# Altium project TimeDrive.PrjPcb (part 2 of 3)

## Sheet 10-Microcontroller-1.SchDoc
size A; SheetNumber: 10; SheetTotal: 16
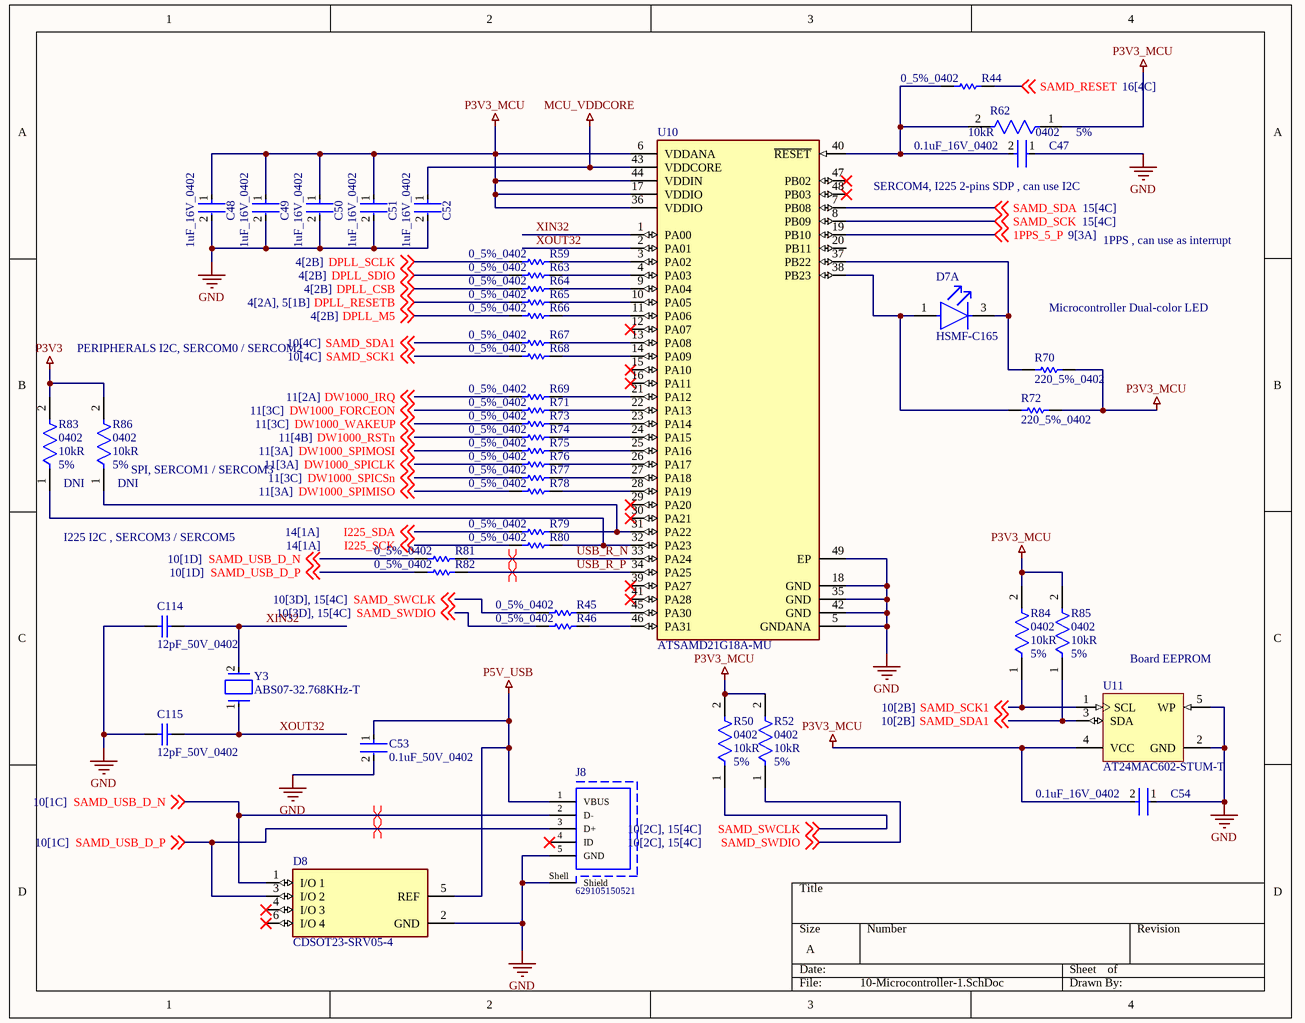
[diagram p6: 10-Microcontroller-1.SchDoc]

### Parts
C47  0.1uF_16V_0402  [FP-GRM15-MFG]
C48  1uF_16V_0402  [FP-0402-L_1_0_0_05-W_0_5-IPC_A]
C49  1uF_16V_0402  [FP-0402-L_1_0_0_05-W_0_5-IPC_A]
C50  1uF_16V_0402  [FP-0402-L_1_0_0_05-W_0_5-IPC_A]
C51  1uF_16V_0402  [FP-0402-L_1_0_0_05-W_0_5-IPC_A]
C52  1uF_16V_0402  [FP-0402-L_1_0_0_05-W_0_5-IPC_A]
C53  0.1uF_50V_0402  [FP-C1005-050-0_05-IPC_C]
C54  0.1uF_16V_0402  [FP-GRM15-MFG]
C114  12pF_50V_0402  [CAPC1005X55X25LL05T05]
C115  12pF_50V_0402  [CAPC1005X55X25LL05T05]
D7  HSMF-C165  [FP-HSMF-C165-MFG]  (part A of 2)
D8  CDSOT23-SRV05-4  [FP-CDSOT23-SRV05-4-MFG]
J8  629105150521  [629105150521]
R44  0_5%_0402  [RESC1005X40X25LL10T10]
R45  0_5%_0402  [RESC1005X40X25LL10T10]
R46  0_5%_0402  [RESC1005X40X25LL10T10]
R50  Case/Package: 0402  Resistance: 10kR  Tolerance: 5%  [FP-CRCW0402-e3-IPC_B]  (hidden comment: CRCW040210K0JNED)
R52  Case/Package: 0402  Resistance: 10kR  Tolerance: 5%  [FP-CRCW0402-e3-IPC_B]  (hidden comment: CRCW040210K0JNED)
R59  0_5%_0402  [RESC1005X40X25LL10T10]
R62  Case/Package: 0402  Resistance: 10kR  Tolerance: 5%  [FP-CRCW0402-e3-IPC_B]  (hidden comment: CRCW040210K0JNED)
R63  0_5%_0402  [RESC1005X40X25LL10T10]
R64  0_5%_0402  [RESC1005X40X25LL10T10]
R65  0_5%_0402  [RESC1005X40X25LL10T10]
R66  0_5%_0402  [RESC1005X40X25LL10T10]
R67  0_5%_0402  [RESC1005X40X25LL10T10]
R68  0_5%_0402  [RESC1005X40X25LL10T10]
R69  0_5%_0402  [RESC1005X40X25LL10T10]
R70  220_5%_0402  [RESC1005X40X25ML05T05]
R71  0_5%_0402  [RESC1005X40X25LL10T10]
R72  220_5%_0402  [RESC1005X40X25ML05T05]
R73  0_5%_0402  [RESC1005X40X25LL10T10]
R74  0_5%_0402  [RESC1005X40X25LL10T10]
R75  0_5%_0402  [RESC1005X40X25LL10T10]
R76  0_5%_0402  [RESC1005X40X25LL10T10]
R77  0_5%_0402  [RESC1005X40X25LL10T10]
R78  0_5%_0402  [RESC1005X40X25LL10T10]
R79  0_5%_0402  [RESC1005X40X25LL10T10]
R80  0_5%_0402  [RESC1005X40X25LL10T10]
R81  0_5%_0402  [RESC1005X40X25LL10T10]
R82  0_5%_0402  [RESC1005X40X25LL10T10]
R83  Case/Package: 0402  Resistance: 10kR  Tolerance: 5%  [FP-CRCW0402-e3-IPC_B]  (hidden comment: CRCW040210K0JNED)
R84  Case/Package: 0402  Resistance: 10kR  Tolerance: 5%  [FP-CRCW0402-e3-IPC_B]  (hidden comment: CRCW040210K0JNED)
R85  Case/Package: 0402  Resistance: 10kR  Tolerance: 5%  [FP-CRCW0402-e3-IPC_B]  (hidden comment: CRCW040210K0JNED)
R86  Case/Package: 0402  Resistance: 10kR  Tolerance: 5%  [FP-CRCW0402-e3-IPC_B]  (hidden comment: CRCW040210K0JNED)
U10  ATSAMD21G18A-MU  [FP-C04-21493-MFG]
U11  AT24MAC602-STUM-T  [ATML-5TS1_M]
Y3  ABS07-32.768KHz-T  [FP-ABS07-MFG]

### Nets
GND: C47.1 C48.2 C49.2 C50.2 C51.2 C52.2 C53.2 C54.1 C114.2 C115.2 D8.2(GND) J8.5(GND) J8.Shell(Shield) U10.5(GNDANA) U10.18(GND) U10.35(GND) U10.42(GND) U10.49(EP) U11.2(GND) U11.5(WP)
MCU_VDDCORE: C52.1 U10.43(VDDCORE)
P3V3: R83.2 R86.2
P3V3_MCU: C48.1 C49.1 C50.1 C51.1 C54.2 R50.2 R52.2 R62.1 R70.2 R72.2 R84.2 R85.2 U10.6(VDDANA) U10.17(VDDIO) U10.36(VDDIO) U10.44(VDDIN) U11.4(VCC)
P5V_USB: C53.1 D8.5(REF) J8.1(VBUS)
1PPS_5_P: U10.19(PB10) ; off-sheet 1PPS_5_P
DPLL_CSB: R64.1 ; off-sheet DPLL_CSB
DPLL_M5: R66.1 ; off-sheet DPLL_M5
DPLL_RESETB: R65.1 ; off-sheet DPLL_RESETB
DPLL_SCLK: R59.1 ; off-sheet DPLL_SCLK
DPLL_SDIO: R63.1 ; off-sheet DPLL_SDIO
DW1000_FORCEON: R71.1 ; off-sheet DW1000_FORCEON
DW1000_IRQ: R69.1 ; off-sheet DW1000_IRQ
DW1000_RSTn: R74.1 ; off-sheet DW1000_RSTn
DW1000_SPICLK: R76.1 ; off-sheet DW1000_SPICLK
DW1000_SPICSn: R77.1 ; off-sheet DW1000_SPICSn
DW1000_SPIMISO: R78.1 ; off-sheet DW1000_SPIMISO
DW1000_SPIMOSI: R75.1 ; off-sheet DW1000_SPIMOSI
DW1000_WAKEUP: R73.1 ; off-sheet DW1000_WAKEUP
I225_SCK: R80.1 ; off-sheet I225_SCK
I225_SDA: R79.1 ; off-sheet I225_SDA
SAMD_RESET: R44.2 ; off-sheet SAMD_RESET
SAMD_SCK: U10.8(PB09) ; off-sheet SAMD_SCK
SAMD_SCK1: R68.1 R84.1 U11.1(SCL) ; off-sheet SAMD_SCK1
SAMD_SDA: U10.7(PB08) ; off-sheet SAMD_SDA
SAMD_SDA1: R67.1 R85.1 U11.3(SDA) ; off-sheet SAMD_SDA1
SAMD_SWCLK: R45.1 R50.1 ; off-sheet SAMD_SWCLK
SAMD_SWDIO: R46.1 R52.1 ; off-sheet SAMD_SWDIO
SAMD_USB_D_N: D8.1(I/O_1) J8.2(D-) R81.1 ; off-sheet SAMD_USB_D_N
SAMD_USB_D_P: D8.3(I/O_2) J8.3(D+) R82.1 ; off-sheet SAMD_USB_D_P
USB_R_N: R81.2 U10.33(PA24)
USB_R_P: R82.2 U10.34(PA25)
XIN32: C114.1 U10.1(PA00) Y3.2
XOUT32: C115.1 U10.2(PA01) Y3.1
NetC47_2: C47.2 R44.1 R62.2 U10.40(~{RESET})
NetD7_1: D7.1(GREEN_A) R72.1 U10.38(PB23)
NetD7_3: D7.3(GREEN_C) R70.1 U10.37(PB22)
NetR45_2: R45.2 U10.45(PA30)
NetR46_2: R46.2 U10.46(PA31)
NetR59_2: R59.2 U10.3(PA02)
NetR63_2: R63.2 U10.4(PA03)
NetR64_2: R64.2 U10.9(PA04)
NetR65_2: R65.2 U10.10(PA05)
NetR66_2: R66.2 U10.11(PA06)
NetR67_2: R67.2 U10.13(PA08)
NetR68_2: R68.2 U10.14(PA09)
NetR69_2: R69.2 U10.21(PA12)
NetR71_2: R71.2 U10.22(PA13)
NetR73_2: R73.2 U10.23(PA14)
NetR74_2: R74.2 U10.24(PA15)
NetR75_2: R75.2 U10.25(PA16)
NetR76_2: R76.2 U10.26(PA17)
NetR77_2: R77.2 U10.27(PA18)
NetR78_2: R78.2 U10.28(PA19)
NetR79_2: R79.2 R86.1 U10.31(PA22)
NetR80_2: R80.2 R83.1 U10.32(PA23)

Not connected (* = marked no-connect by the designer): D8 4(I/O_3)* 6(I/O_4)*; J8 4(ID)*; U10 12(PA07)* 15(PA10)* 16(PA11)* 20(PB11) 29(PA20)* 30(PA21)* 39(PA27)* 41(PA28)* 47(PB02)* 48(PB03)*

### Layout directives
differential pair: SAMD_USB_D_N, SAMD_USB_D_P, USB_R_N, USB_R_P

### Notes on the sheet
- (near C47) SERCOM4, I225 2-pins SDP , can use I2C
- 1PPS , can use as interrupt
- PERIPHERALS I2C, SERCOM0 / SERCOM2
- Microcontroller Dual-color LED
- (near R86) SPI, SERCOM1 / SERCOM3
- I225 I2C , SERCOM3 / SERCOM5
- (near U11) Board EEPROM

### Library data of the parts
C47 C54 = CMP-2100-03641-2: CAP CER 0.1UF 16V X7R 0402; Manufacturer Part Number: GRM155R71C104KA88D; Manufacturer: Murata; Standoff Height: 0mm; Tolerance: 10%; Voltage Rating: 16Vdc; Material: Ceramic; Capacitance: 0.10μF; Value: 0.10μF; RoHS: TRUE; Temperature Characteristic: X7R; Octopart: https://octopart.com/grm155r71c104ka88d-murata-196880; Digikey Description: CAP CER 0.1UF 16V X7R 0402; Device Class L3: Ceramic Capacitors; Height: 0.55mm; ComponentLink2Description: Datasheet; Temperature Range Low: -55°C; Ipc Land Pattern Name: CAPC10050X219; ComponentLink2URL: https://search.murata.co.jp/Ceramy/image/img/A01X/G101/ENG/GRM155R71H471KA01-01A.pdf; Device Class L1: Passive Components; Lead Free: yes; Category: Cap; Package: GRM15; Temperature: -55°C to +125°C; Device Class L2: Capacitors; Temperature Range High: +125°C; Mouser Description: 0402 0.1 uF 16V ±10 % Tolerance X7R SMT Multilayer Ceramic Capacitor
C48-C52 = CMP-14477-000104-2: None; Tolerance: 10%; Voltage Rating: 16V; Dielectric: X5R; Capacitance: 1uF; Packaging: Tape and Reel; Depth: 0.5mm; Mount: Surface Mount; Thickness: 0.022inch; Package Quantity: 1; Min Operating Temperature: -55°C; Series: M; Voltage Rating (DC): 16V; Termination: SMD/SMT; Case/Package: 0402; Number of Pins: 2; Case Code (Imperial): 0402; Length: 1mm; Halogen Free: Halogen Free; Case Code (Metric): 1005; Width: 0.02inch; RoHS Compliant: Yes; Radiation Hardening: No; Max Operating Temperature: 85°C; Height: 0.5mm; Construction: Flat
C53 = CMP-2000-05393-2: Multilayer Ceramic Capacitors 100nF ±10% 50V X7R SMD 0402; Voltage: 50V; Dielectric Material: Ceramic; Min Operating Temperature: -55°C; Depth: 0.5mm; Radiation Hardening: No; RoHS Compliant: Yes; Voltage Rating (DC): 50V; Lead Free: Lead Free; Resistor Type: Ceramic; Height: 0.5mm; Dielectric: X7R; Thickness: 0.022inch; Case/Package: 0402; Case Code (Metric): 1005; Termination: SMD/SMT; Capacitance: 100nF; Packaging: Tape and Reel; Max Operating Temperature: 125°C; Mount: Surface Mount; Package Quantity: 1; Width: 0.02inch; Weight: 2.3E-05oz; Voltage Rating: 50V; Tolerance: 10%; Construction: Flat; Case Code (Imperial): 0402; Length: 1mm; REACH SVHC: No SVHC; Series: C
C114 C115 = CMP-2000-06069-1: Chip Capacitor, 12 pF, +/- 5%, 50 V, -55 to 125 degC, 0402 (1005 Metric), RoHS, Tape and Reel; Manufacturer: Yageo; Capacitance: 12pF; Voltage - Rated: 50V; Other Names: 311-1016-6311-1266-6311-1266-6-ND; Catalog Drawings: CC_0402; Featured Product: CommodityMultilayerCeramicCapacitors–CCSeries; Product Training Modules: MultilayerCeramicCapacitors; Online Catalog: CCSeries; Temperature Coefficient: C0G,NP0; Mounting Technology: SurfaceMount; Package Reference: 0402; Lead Style: -; Datasheet URL: http://www.yageo.com/NewPortal/yageodocoutput?fileName=/pdf/MLCC/UPY-GP_NP0_16V-to-50V_14.pdf; Height - Seated (Max): -; Mounting Type: SurfaceMount,MLCC; Series: CC; Standard Package: 1; Manufacturer URL: http://www.yageo.com/; Package / Case: 0402(1005Metric); Features: -; Applications: GeneralPurpose; Family: CeramicCapacitors; Size / Dimension: 0.039"Lx0.020"W(1.00mmx0.50mm); Ratings: -; Package Description: 2-Pin Surface Mount Device, Body 1 x 0.5 mm; Datasheet Version: Rev. 14, 07/2016; Lead Spacing: -; Packaging: Digi-Reel®; Category: Capacitors; Tolerance: ±5%; Thickness (Max): 0.022"(0.55mm); Operating Temperature: -55°C~125°C
D7 = CMP-2000-06424-2: LED GREEN/RED DIFFUSED 0603 SMD; Reverse Voltage: 5V; Dominant Wavelength: 621nm; Number of Elements: 2; Shape: Rectangular; Luminous Intensity: 10mcd; Forward Current: 20mA; Lens Color: White; Illumination Color: Green; Power Dissipation: 52mW; Wavelength: 572nm; Viewing Angle: 120°; Forward Voltage: 2.2V; Max Operating Temperature: 85°C; Lens Transparency: Diffused; Width: 0.8mm; Case/Package: 0603; Packaging: Tape and Reel; Case Code (Metric): 1608; Depth: 0.8mm; REACH SVHC: No SVHC; Number of LEDs: 2; Radiation Hardening: No; Lens Style: Rectangular; Color: Green; Case Code (Imperial): 0603; Min Operating Temperature: -40°C; Power Rating: 52mW; Number of Pins: 4; Number of Terminals: 4; Package Quantity: 1; Mount: Surface Mount; Height: 0.5mm; Length: 1.6mm; Lead Free: Lead Free; Test Current: 20mA
D8 = CMP-07401-000007-1: TVS DIODE 5V 15V SOT23-6; Manufacturer: Bourns Inc.; Standoff Height: 0.2mm; Direction: Bidirectional; Peak Pulse Power: 500W; Max Junction Temp: +150°C; Number Of Channels: 4; Breakdown Voltage: 6V; Peak Pulse Current: 30A; Temperature Range High: +150°C; RoHS: TRUE; Category: Diode; Clamping Voltage: 15V; Reverse Standoff Voltage: 5V; Manufacturer Part Number: CDSOT23-SRV05-4; Octopart: https://octopart.com/cdsot23-srv05-4-bourns-1679449; Automotive: No; ComponentLink2URL: https://www.bourns.com/docs/Product-Datasheets/CDSOT23-SRV05-4.pdf; Device Class L1: Circuit Protection; Temperature: -55°C to +150°C; Device Class L2: TVS Diodes; Temperature Range Low: -55°C; Lead Free: Yes; Device Class L3: unset; Height: 1.45mm; Package: CDSOT23-SRV05-4; Ipc Land Pattern Name: SOT95P280X118-6; Mouser Description: CDSOT23-SRV05-4, Quad Uni-Directional TVS Diode, 500W, 6-Pin SOT-23; ComponentLink2Description: Datasheet; Digikey Description: TVS DIODE 5V 15V SOT23-6
J8 = CMP-1502-03252-1: Micro USB 2.0 Type B Receptacle WR-COM, Horizontal, SMT, with Pegs, High Current at Pin 1 & Pin 5; Manufacturer: Wurth Elektronik; Contact Resistance: 30mOhm; Rated Current: 3A; Working Voltage: 30VAC; Package Reference: 629105150521; Mounting Technology: SMT; Connector Type: MicroUSB2.0TypeB; Operating Temperature: -40to85degC; Orientation: Horizontal; Manufacturer URL: http://www.we-online.de; Datasheet URL: https://katalog.we-online.de/em/datasheet/629105150521.pdf; Part Number: 629105150521; Packaging: TapeandReel; Gender: Receptacle; Publisher: WurthElektronik
R44-R46 R59 R63-R69 R71 R73-R82 = CMP-2002-04569-1: Manufacturer: KOA Speer; Part Number: RK73Z1ETTP
R50 R52 R62 R83-R86 = CMP-2002-08136-3: RES Thick Film, 10kΩ, 5%, 0.063W, 200ppm/°C, 0402; Voltage Rating: 50V; Power Rating: 63mW; Military Standard: Not; Packaging: Tape and Reel; Case Code (Imperial): 0402; Min Operating Temperature: -55°C; Case Code (Metric): 1005; Temperature Coefficient: 200ppm/°C; Termination: SMD/SMT; Composition: Thick Film; Depth: 0.5mm; Number of Terminations: 2; Contact Plating: Tin; Height: 0.016inch; Width: 0.5mm; Max Operating Temperature: 155°C; Features: Automotive AEC-Q200; Length: 1mm; Radiation Hardening: No; Max Power Dissipation: 63mW; Mount: Surface Mount; Package Quantity: 1; Weight: 2.3E-05oz
  R83 R86: DNI: DNI
R70 R72 = CMP-2002-00486-1: Manufacturer: Panasonic; Part Number: ERJ-2GEJ220X
U10 = CMP-06276-000052-1: IC MCU 32BIT 256KB FLASH 48QFN; Interface: I2C; Oscillator Type: Internal; Core Architecture: ARM; Peripherals: Brown-out Detect/Reset; Number of I/Os: 38; Frequency: 48MHz; Max Operating Temperature: 85°C; Memory Size: 256KB; Memory Type: FLASH; Case/Package: QFN; Packaging: Tray; Min Operating Temperature: -40°C
U11 = CMP-2100-03583-1: 2-Kbit (256 x 8), 2-wire Serial EEPROM with a Factory-Programmed EUI-64(TM)Address Plus an Embedded Unique 128-bit Serial Number, 1.7 to 5.5 V, -40 to 85 degC, 5-Pin SOT23 (5TS1), Tape and Reel; Manufacturer: Atmel; Min Supply Voltage: 1.7V; Nominal Supply Current: 3mA; Max Frequency: 1MHz; Max Supply Voltage: 5.5V; Number of Pins: 5; RoHSCompliant: true; Mount: SurfaceMount; Datasheet URL: http://www.atmel.com/Images/Atmel-8807-SEEPROM-AT24MAC402-602-Datasheet.pdf; Frequency: 1MHz; Min Operating Temperature: -40degC; Package Reference: 5TS1; Radiation Hardening: No; Package Description: 5-Pin Plastic Thin Shrink Small Outline Package, Body 2.9 x 1.6 mm, Pitch 0.95 mm; Package Quantity: 5000; Packaging: TapeandReel; Max Operating Temperature: 85degC; Case/Package: SOT-23; Manufacturer URL: http://www.atmel.com/; Datasheet Version: Rev. 8808E, 01/2015
Y3 = CMP-0447-00001-3: CRYSTAL 32.7680KHZ 12.5PF SMD; Frequency Tolerance: 20ppm; Series Resistance: 70kR; Operating Frequency: 32.768 kHz; Number of Pins: 2; Package Quantity: 3000; Tolerance: 20ppm; Max Operating Temperature: 85°C; Width: 0.061inch; Frequency: 32.768kHz; Termination: SMD/SMT; Min Operating Temperature: -40°C; Radiation Hardening: No; Series: ABS07; Length: 3.2mm; Case/Package: CSMD; ESR (Equivalent Series Resistance): 70kR; RoHS Compliant: Yes; Load Capacitance: 12.5pF; Depth: 1.5mm; REACH SVHC: No SVHC; Height: 0.035inch; Packaging: Tape and Reel; Lead Free: Lead Free

## Sheet 11-UWB-Main.SchDoc
size A; SheetNumber: 11; SheetTotal: 16
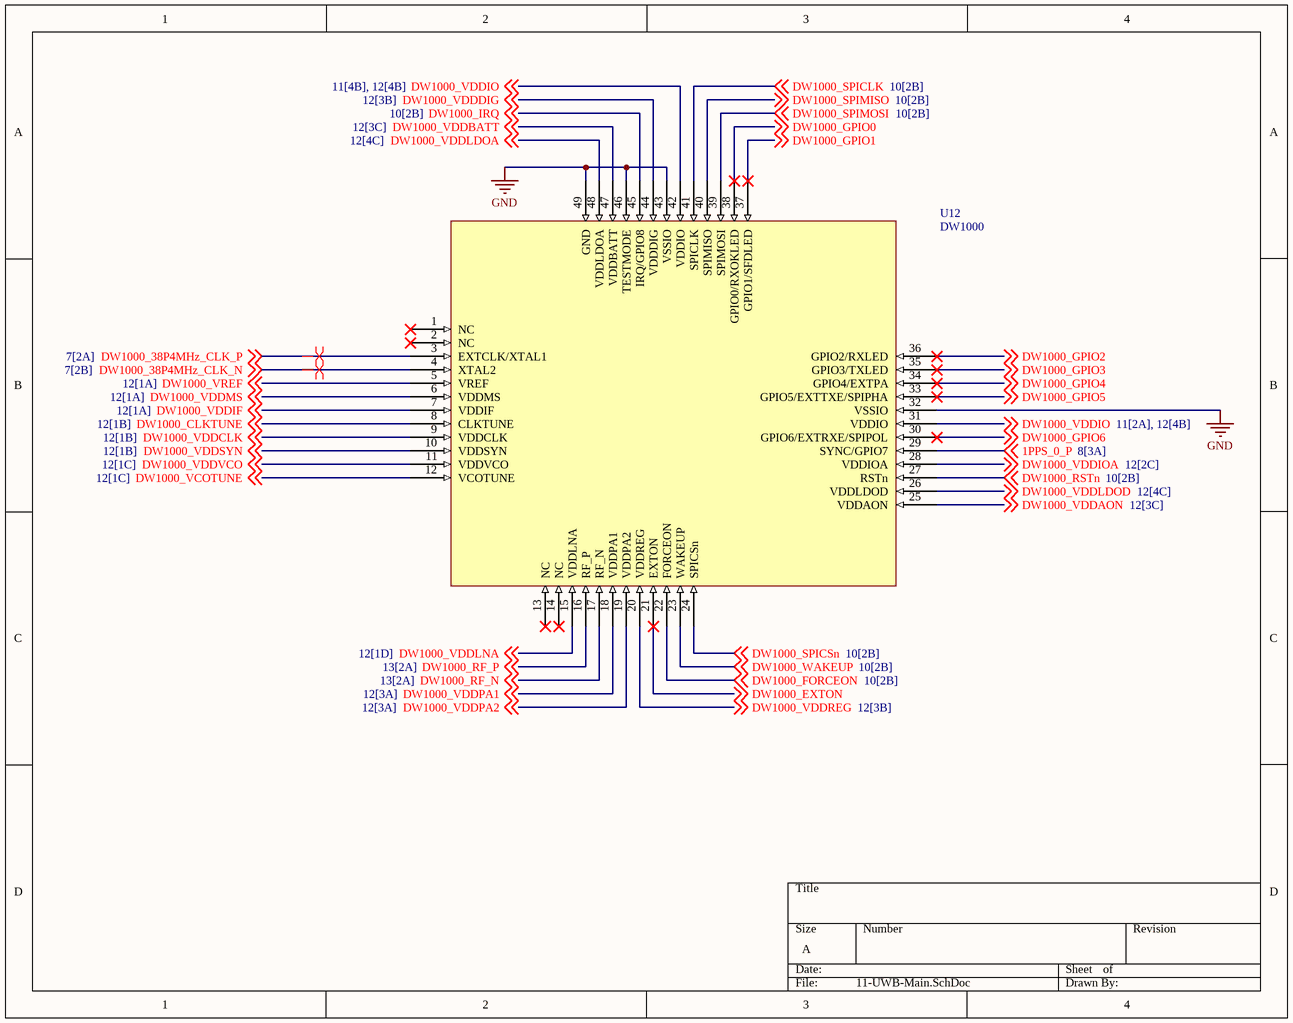
[diagram p7: 11-UWB-Main.SchDoc]

### Parts
U12  DW1000  [DW1000_Footprint]

### Nets
GND: U12.32(VSSIO) U12.43(VSSIO) U12.46(TESTMODE) U12.49(GND)
1PPS_0_P: U12.29(SYNC/GPIO7) ; off-sheet 1PPS_0_P
DW1000_38P4MHz_CLK_N: U12.4(XTAL2) ; off-sheet DW1000_38P4MHz_CLK_N
DW1000_38P4MHz_CLK_P: U12.3(EXTCLK/XTAL1) ; off-sheet DW1000_38P4MHz_CLK_P
DW1000_CLKTUNE: U12.8(CLKTUNE) ; off-sheet DW1000_CLKTUNE
DW1000_EXTON: U12.21(EXTON) ; off-sheet DW1000_EXTON
DW1000_FORCEON: U12.22(FORCEON) ; off-sheet DW1000_FORCEON
DW1000_GPIO0: U12.38(GPIO0/RXOKLED) ; off-sheet DW1000_GPIO0
DW1000_GPIO1: U12.37(GPIO1/SFDLED) ; off-sheet DW1000_GPIO1
DW1000_GPIO2: U12.36(GPIO2/RXLED) ; off-sheet DW1000_GPIO2
DW1000_GPIO3: U12.35(GPIO3/TXLED) ; off-sheet DW1000_GPIO3
DW1000_GPIO4: U12.34(GPIO4/EXTPA) ; off-sheet DW1000_GPIO4
DW1000_GPIO5: U12.33(GPIO5/EXTTXE/SPIPHA) ; off-sheet DW1000_GPIO5
DW1000_GPIO6: U12.30(GPIO6/EXTRXE/SPIPOL) ; off-sheet DW1000_GPIO6
DW1000_IRQ: U12.45(IRQ/GPIO8) ; off-sheet DW1000_IRQ
DW1000_RF_N: U12.17(RF_N) ; off-sheet DW1000_RF_N
DW1000_RF_P: U12.16(RF_P) ; off-sheet DW1000_RF_P
DW1000_RSTn: U12.27(RSTn) ; off-sheet DW1000_RSTn
DW1000_SPICLK: U12.41(SPICLK) ; off-sheet DW1000_SPICLK
DW1000_SPICSn: U12.24(SPICSn) ; off-sheet DW1000_SPICSn
DW1000_SPIMISO: U12.40(SPIMISO) ; off-sheet DW1000_SPIMISO
DW1000_SPIMOSI: U12.39(SPIMOSI) ; off-sheet DW1000_SPIMOSI
DW1000_VCOTUNE: U12.12(VCOTUNE) ; off-sheet DW1000_VCOTUNE
DW1000_VDDAON: U12.25(VDDAON) ; off-sheet DW1000_VDDAON
DW1000_VDDBATT: U12.47(VDDBATT) ; off-sheet DW1000_VDDBATT
DW1000_VDDCLK: U12.9(VDDCLK) ; off-sheet DW1000_VDDCLK
DW1000_VDDDIG: U12.44(VDDDIG) ; off-sheet DW1000_VDDDIG
DW1000_VDDIF: U12.7(VDDIF) ; off-sheet DW1000_VDDIF
DW1000_VDDIO: U12.31(VDDIO) U12.42(VDDIO) ; off-sheet DW1000_VDDIO
DW1000_VDDIOA: U12.28(VDDIOA) ; off-sheet DW1000_VDDIOA
DW1000_VDDLDOA: U12.48(VDDLDOA) ; off-sheet DW1000_VDDLDOA
DW1000_VDDLDOD: U12.26(VDDLDOD) ; off-sheet DW1000_VDDLDOD
DW1000_VDDLNA: U12.15(VDDLNA) ; off-sheet DW1000_VDDLNA
DW1000_VDDMS: U12.6(VDDMS) ; off-sheet DW1000_VDDMS
DW1000_VDDPA1: U12.18(VDDPA1) ; off-sheet DW1000_VDDPA1
DW1000_VDDPA2: U12.19(VDDPA2) ; off-sheet DW1000_VDDPA2
DW1000_VDDREG: U12.20(VDDREG) ; off-sheet DW1000_VDDREG
DW1000_VDDSYN: U12.10(VDDSYN) ; off-sheet DW1000_VDDSYN
DW1000_VDDVCO: U12.11(VDDVCO) ; off-sheet DW1000_VDDVCO
DW1000_VREF: U12.5(VREF) ; off-sheet DW1000_VREF
DW1000_WAKEUP: U12.23(WAKEUP) ; off-sheet DW1000_WAKEUP

Not connected (* = marked no-connect by the designer): U12 1(NC)* 2(NC)* 13(NC)* 14(NC)*

### Layout directives
differential pair: DW1000_38P4MHz_CLK_N, DW1000_38P4MHz_CLK_P

## Sheet 13-UWB-Antenna.SchDoc
size A; SheetNumber: 13; SheetTotal: 16
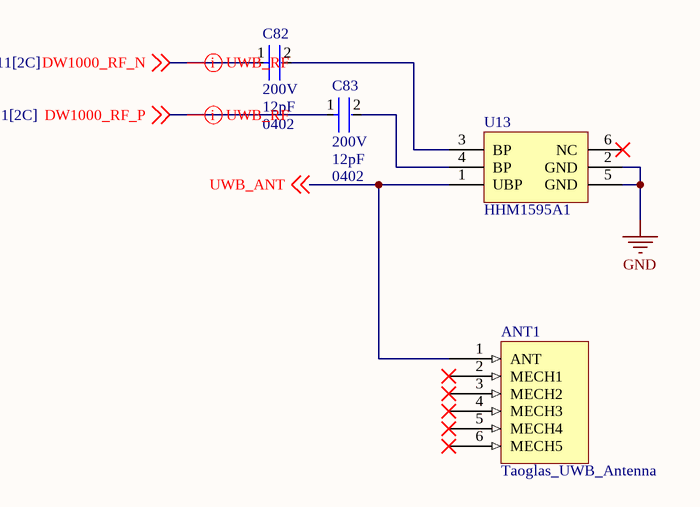
[diagram p8: 13-UWB-Antenna.SchDoc]

### Parts
ANT1  Taoglas_UWB_Antenna  [UWC.20 Antenna]
C82  Voltage Rating (DC): 200V  Capacitance: 12pF  Case/Package: 0402  [FP-GQM155-0_05-MFG]  (hidden comment: GQM1555C2D120FB01D)
C83  Voltage Rating (DC): 200V  Capacitance: 12pF  Case/Package: 0402  [FP-GQM155-0_05-MFG]  (hidden comment: GQM1555C2D120FB01D)
U13  HHM1595A1  [TDK-HHM1595A1_V]

### Nets
GND: U13.2(GND) U13.5(GND)
DW1000_RF_N: C82.1 ; off-sheet DW1000_RF_N
DW1000_RF_P: C83.1 ; off-sheet DW1000_RF_P
UWB_ANT: ANT1.1(ANT) U13.1(UBP) ; off-sheet UWB_ANT
NetC82_2: C82.2 U13.3(BP)
NetC83_2: C83.2 U13.4(BP)

Not connected (* = marked no-connect by the designer): ANT1 2(MECH1)* 3(MECH2)* 4(MECH3)* 5(MECH4)* 6(MECH5)*; U13 6(NC)*

### Layout directives
differential pair: DW1000_RF_N, DW1000_RF_P

### Library data of the parts
C82 C83 = CMP-06035-014182-1: Ceramic Capacitor 12pF  ±1% 200VDC C0G 0402 Paper T/R; Tolerance: 1%; Width: 0.02inch; Dielectric: C0G; Voltage Rating: 200V; Packaging: Tape and Reel; Thickness: 0.022inch; Length: 0.039inch; Mount: Surface Mount; Min Operating Temperature: -55°C; Max Operating Temperature: 125°C
U13 = CMP-2000-07459-1: Multilayer Balun, 3000 to 8000 MHz, -40 to 85 degC, 6-Pin SMD, RoHS, Tape and Reel; Manufacturer: TDK; Case\/Package: 0805; Impedance: 100Ohm; Insertion Loss: 1.5dB; Radiation Hardening: No; Number of Pins: 6; Manufacturer URL: http://www.tdk.com/; Min Operating Temperature: -40degC; Mounting Technology: SurfaceMount; RoHSCompliant: true; Package Description: 6-Pin Surface Mount Device, Body 2 x 1.25 mm, Pitch 0.65 mm; Datasheet URL: https://product.tdk.com/info/en/documents/data_sheet/rf_balun_hhm1595a1_en.pdf; Package Quantity: 1; Max Operating Temperature: 85degC; Packaging: TapeandReel; Package Reference: HHM1595A1; Termination: SMD/SMT; Datasheet Version: 04/2015; Case Code (Imperial): 0805; Case Code (Metric): 2012

## Sheet 14-I225-Main.SchDoc
size A; SheetNumber: 14; SheetTotal: 16
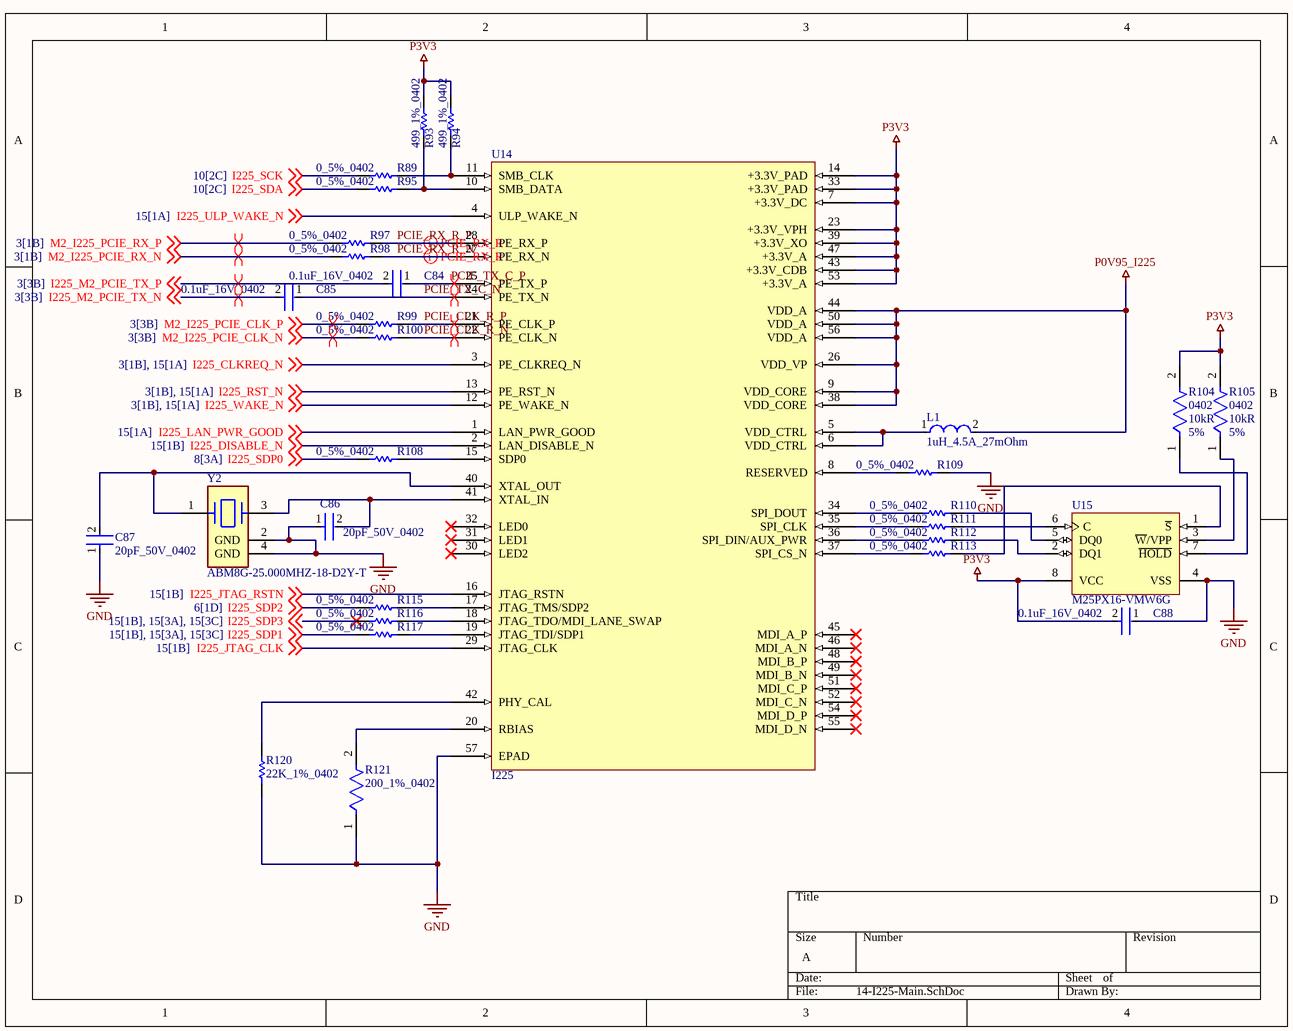
[diagram p9: 14-I225-Main.SchDoc]

### Parts
C84  0.1uF_16V_0402  [FP-GRM15-MFG]
C85  0.1uF_16V_0402  [FP-GRM15-MFG]
C86  20pF_50V_0402  [FP-C0402-BB-MFG]
C87  20pF_50V_0402  [FP-C0402-BB-MFG]
C88  0.1uF_16V_0402  [FP-GRM15-MFG]
L1  1uH_4.5A_27mOhm  [FP-IHLP-1616BZ-FP_1_8545x-MFG]
R89  0_5%_0402  [RESC1005X40X25LL10T10]
R93  499_1%_0402  [RESC1005X40X25LL05T05]
R94  499_1%_0402  [RESC1005X40X25LL05T05]
R95  0_5%_0402  [RESC1005X40X25LL10T10]
R97  0_5%_0402  [RESC1005X40X25LL10T10]
R98  0_5%_0402  [RESC1005X40X25LL10T10]
R99  0_5%_0402  [RESC1005X40X25LL10T10]
R100  0_5%_0402  [RESC1005X40X25LL10T10]
R104  Case/Package: 0402  Resistance: 10kR  Tolerance: 5%  [FP-CRCW0402-e3-IPC_B]  (hidden comment: CRCW040210K0JNED)
R105  Case/Package: 0402  Resistance: 10kR  Tolerance: 5%  [FP-CRCW0402-e3-IPC_B]  (hidden comment: CRCW040210K0JNED)
R108  0_5%_0402  [RESC1005X40X25LL10T10]
R109  0_5%_0402  [RESC1005X40X25LL10T10]
R110  0_5%_0402  [RESC1005X40X25LL10T10]
R111  0_5%_0402  [RESC1005X40X25LL10T10]
R112  0_5%_0402  [RESC1005X40X25LL10T10]
R113  0_5%_0402  [RESC1005X40X25LL10T10]
R115  0_5%_0402  [RESC1005X40X25LL10T10]
R116  0_5%_0402  [RESC1005X40X25LL10T10]
R117  0_5%_0402  [RESC1005X40X25LL10T10]
R120  22K_1%_0402  [RESC1005X40X25NL05T05]
R121  200_1%_0402  [FP-CRCW0402-e3-IPC_C]
U14  I225  [I225 QFN56]
U15  M25PX16-VMW6G  [MICT-MW-8_N]
Y2  ABM8G-25.000MHZ-18-D2Y-T  [FP-ABM8G-MFG]

### Nets
GND: C86.1 C87.1 C88.1 R109.2 R120.1 R121.1 U14.57(EPAD) U15.4(VSS) Y2.2(GND) Y2.4(GND)
P0V95_I225: L1.2 U14.9(VDD_CORE) U14.26(VDD_VP) U14.38(VDD_CORE) U14.44(VDD_A) U14.50(VDD_A) U14.56(VDD_A)
P3V3: C88.2 R93.2 R94.2 R104.2 R105.2 U14.7(+3.3V_DC) U14.14(+3.3V_PAD) U14.23(+3.3V_VPH) U14.33(+3.3V_PAD) U14.39(+3.3V_XO) U14.43(+3.3V_CDB) U14.47(+3.3V_A) U14.53(+3.3V_A) U15.8(VCC)
I225_CLKREQ_N: U14.3(PE_CLKREQ_N) ; off-sheet I225_CLKREQ_N
I225_DISABLE_N: U14.2(LAN_DISABLE_N) ; off-sheet I225_DISABLE_N
I225_JTAG_CLK: U14.29(JTAG_CLK) ; off-sheet I225_JTAG_CLK
I225_JTAG_RSTN: U14.16(JTAG_RSTN) ; off-sheet I225_JTAG_RSTN
I225_LAN_PWR_GOOD: U14.1(LAN_PWR_GOOD) ; off-sheet I225_LAN_PWR_GOOD
I225_M2_PCIE_TX_N: C85.2 ; off-sheet I225_M2_PCIE_TX_N
I225_M2_PCIE_TX_P: C84.2 ; off-sheet I225_M2_PCIE_TX_P
I225_RST_N: U14.13(PE_RST_N) ; off-sheet I225_RST_N
I225_SCK: R89.1 ; off-sheet I225_SCK
I225_SDA: R95.1 ; off-sheet I225_SDA
I225_SDP0: R108.1 ; off-sheet I225_SDP0
I225_SDP1: R117.1 ; off-sheet I225_SDP1
I225_SDP2: R115.1 ; off-sheet I225_SDP2
I225_SDP3: R116.1 ; off-sheet I225_SDP3
I225_ULP_WAKE_N: U14.4(ULP_WAKE_N) ; off-sheet I225_ULP_WAKE_N
I225_WAKE_N: U14.12(PE_WAKE_N) ; off-sheet I225_WAKE_N
M2_I225_PCIE_CLK_N: R100.1 ; off-sheet M2_I225_PCIE_CLK_N
M2_I225_PCIE_CLK_P: R99.1 ; off-sheet M2_I225_PCIE_CLK_P
M2_I225_PCIE_RX_N: R98.1 ; off-sheet M2_I225_PCIE_RX_N
M2_I225_PCIE_RX_P: R97.1 ; off-sheet M2_I225_PCIE_RX_P
PCIE_CLK_R_N: R100.2 U14.22(PE_CLK_N)
PCIE_CLK_R_P: R99.2 U14.21(PE_CLK_P)
PCIE_RX_R_N: R98.2 U14.27(PE_RX_N)
PCIE_RX_R_P: R97.2 U14.28(PE_RX_P)
PCIE_TX_C_N: C85.1 U14.24(PE_TX_N)
PCIE_TX_C_P: C84.1 U14.25(PE_TX_P)
NetC86_2: C86.2 U14.41(XTAL_IN) Y2.3
NetC87_2: C87.2 U14.40(XTAL_OUT) Y2.1
NetL1_1: L1.1 U14.5(VDD_CTRL) U14.6(VDD_CTRL)
NetR89_2: R89.2 R94.1 U14.11(SMB_CLK)
NetR93_1: R93.1 R95.2 U14.10(SMB_DATA)
NetR104_1: R104.1 U15.7(~{HOLD})
NetR105_1: R105.1 U15.3(~{W}/VPP)
NetR108_2: R108.2 U14.15(SDP0)
NetR109_1: R109.1 U14.8(RESERVED)
NetR110_1: R110.1 U14.34(SPI_DOUT)
NetR110_2: R110.2 U15.5(DQ0)
NetR111_1: R111.1 U14.35(SPI_CLK)
NetR111_2: R111.2 U15.6(C)
NetR112_1: R112.1 U14.36(SPI_DIN/AUX_PWR)
NetR112_2: R112.2 U15.2(DQ1)
NetR113_1: R113.1 U14.37(SPI_CS_N)
NetR113_2: R113.2 U15.1(~{S})
NetR115_2: R115.2 U14.17(JTAG_TMS/SDP2)
NetR116_2: R116.2 U14.18(JTAG_TDO/MDI_LANE_SWAP)
NetR117_2: R117.2 U14.19(JTAG_TDI/SDP1)
NetR120_2: R120.2 U14.42(PHY_CAL)
NetR121_2: R121.2 U14.20(RBIAS)

Not connected (* = marked no-connect by the designer): U14 30(LED2)* 31(LED1)* 32(LED0)* 45(MDI_A_P)* 46(MDI_A_N)* 48(MDI_B_P)* 49(MDI_B_N)* 51(MDI_C_P)* 52(MDI_C_N)* 54(MDI_D_P)* 55(MDI_D_N)*

### Layout directives
differential pair: I225_M2_PCIE_TX_N, I225_M2_PCIE_TX_P, M2_I225_PCIE_CLK_N, M2_I225_PCIE_CLK_P, M2_I225_PCIE_RX_N, M2_I225_PCIE_RX_P, PCIE_CLK_R_N, PCIE_CLK_R_P, PCIE_RX_R_N, PCIE_RX_R_P, PCIE_TX_C_N, PCIE_TX_C_P

### Library data of the parts
C84 C85 C88 = CMP-2100-03641-2: as C47 on sheet 10-Microcontroller-1; RoHS: TRUE; Temperature Characteristic: X7R; Octopart: https://octopart.com/grm155r71c104ka88d-murata-196880; Digikey Description: CAP CER 0.1UF 16V X7R 0402; Device Class L3: Ceramic Capacitors; Height: 0.55mm; ComponentLink2Description: Datasheet; Temperature Range Low: -55°C; Ipc Land Pattern Name: CAPC10050X219; ComponentLink2URL: https://search.murata.co.jp/Ceramy/image/img/A01X/G101/ENG/GRM155R71H471KA01-01A.pdf; Device Class L1: Passive Components; Lead Free: yes; Category: Cap; Package: GRM15; Temperature: -55°C to +125°C; Device Class L2: Capacitors; Temperature Range High: +125°C; Mouser Description: 0402 0.1 uF 16V ±10 % Tolerance X7R SMT Multilayer Ceramic Capacitor
C86 C87 = CMP-1034-00890-3: CAP CER 20PF 50V 5% NP0 0402; Manufacturer Part Number: C0402C200J5GACTU; Manufacturer: Kemet; Tolerance: 0.05; Material: Ceramic; Temperature Characteristic: C0G; Temperature Coefficient: 15%; Octopart: https://octopart.com/c0402c200j5gactu-kemet-9143900; ComponentLink2Description: Datasheet; RoHS: TRUE; Ipc Land Pattern Name: CAPC10050X50; Temperature: -55°C to +125°C; Lead Free: Yes; Mouser Description: Multilayer Ceramic Capacitors MLCC - SMD/SMT 50volts 20pF C0G 5%; Device Class L1: Passive Components; Category: Cap; Package: C0402-BB; Temperature Range High: +125°C; Voltage Rating: 50 V; Temperature Range Low: -55°C; Device Class L2: Capacitors; Device Class L3: Ceramic Capacitors; Height: 0.55mm; Capacitance: 20 pF; Value: 20 pF; ComponentLink2URL: https://content.kemet.com/datasheets/KEM_C1002_X7R_SMD.pdf; Digikey Description: CAP CER 20PF 50V 5% NP0 0402; Automotive: No
L1 = CMP-02424-000223-1: Fixed Inductors Commercial Low DCR Series SMT 1uH 4.5A 27mΩ 20%; DC Resistance (DCR): 27mR; Core Material: Ferrite; Test Frequency: 100kHz; Shielding: Shielded; Self Resonant Frequency: 64MHz; Saturation Current: 5A; Inductance Tolerance: 20%; Min Operating Temperature: -55°C; Lead Free: Lead Free; Inductance: 1uH; Contact Plating: Tin; Package Quantity: 4000; Military Standard: Not; Depth: 4.31mm; Tolerance: 20%; RMS Current (Irms): 4.5A; Packaging: Tape and Reel; Number of Pins: 1616; Case/Package: 1616; Termination: SMD/SMT; Height: 2mm; Current Rating: 4.5A; Case Code (Metric): 4040; Max Operating Temperature: 125°C; Case Code (Imperial): 1616; Max DC Current: 4.5A; Width: 0.16inch; Mount: Surface Mount; Length: 4.7mm; Radiation Hardening: No; Height - Seated (Max): 0.079inch
R89 R95 R97-R100 R108-R113 R115-R117 = CMP-2002-04569-1: as R44 on sheet 10-Microcontroller-1
R93 R94 = CMP-2002-00965-1: Manufacturer: Panasonic; Part Number: ERJ-2RKF4990X
R104 R105 = CMP-2002-08136-3: as R50 on sheet 10-Microcontroller-1; Military Standard: Not; Packaging: Tape and Reel; Case Code (Imperial): 0402; Min Operating Temperature: -55°C; Case Code (Metric): 1005; Temperature Coefficient: 200ppm/°C; Termination: SMD/SMT; Composition: Thick Film; Depth: 0.5mm; Number of Terminations: 2; Contact Plating: Tin; Height: 0.016inch; Width: 0.5mm; Max Operating Temperature: 155°C; Features: Automotive AEC-Q200; Length: 1mm; Radiation Hardening: No; Max Power Dissipation: 63mW; Mount: Surface Mount; Package Quantity: 1; Weight: 2.3E-05oz
R120 = CMP-1011-00659-2: Part Number: CRCW040222K0FKED; Manufacturer: Vishay Dale
R121 = CMP-1011-00429-3: RES Thick Film, 200Ω, 1%, 0.063W, 100ppm/°C, 0402; Max Power Dissipation: 63mW; Voltage Rating: 50V; Resistance: 200R; Termination: SMD/SMT; Weight: 2.3E-05oz; Case/Package: 0402; Contact Plating: Tin; Number of Pins: 2; Width: 0.5mm; Height: 0.35mm; Case Code (Metric): 1005; Military Standard: Not; Features: Automotive AEC-Q200; Power Rating: 63mW; Temperature Coefficient: 100ppm/°C; Tolerance: 1%; Lead Free: Lead Free; Depth: 0.5mm; Max Operating Temperature: 155°C; Min Operating Temperature: -55°C; Package Quantity: 10; Voltage Rating (DC): 50V; Composition: Thick Film; Mount: Surface Mount; Radiation Hardening: No; Length: 1mm; Packaging: Tape and Reel; Number of Terminations: 2; Case Code (Imperial): 0402
U15 = CMP-0357-00138-1: 16 Mb (x1/x2) Serial NOR Flash Memory with Dual I/O, 75 MHz, 2.3 to 3.6 V, 8-pin SO8 Wide (MW), Tube; Part Family: M25PXÂ; Manufacturer: Micron; Density: 16MbÂ; Voltage: 2.3V-3.6VÂ; Speed: 75 MHzÂ; Mounting Technology: Surface Mount; Part Status: ProductionÂ; Type: Dual I/OÂ; ComponentLink3URL: http://www.micron.com/~/media/Documents/Products/Data%20Sheet/NOR%20Flash/Serial%20NOR/M25P/M25P16.pdf; PartNumber: M25PX16-VMW6G; PackageVersion: Rev 8; ComponentLink2Description: Datasheet; ComponentLink3Description: Package Specification; PackageDescription: 8-Pin SO Wide, 5.62 X 6.05 mm, Pitch 1.27 mm; Applications: EmbeddedÂ; PackageReference: MICT-MW-8; RoHS: YesÂ; ComponentLink1URL: http://www.micron.com/; ComponentLink1Description: Manufacturer URL; Width: x1/x2Â; ComponentLink2URL: http://www.micron.com/~/media/Documents/Products/Data%20Sheet/NOR%20Flash/Serial%20NOR/M25P/M25P16.pdf; Package: SO8 WideÂ; DatasheetVersion: Rev. 8
Y2 = CMP-2000-05733-2: CRYSTAL 25.0000MHZ 18PF SMD; Manufacturer: Abracon; Stability: 30ppm; Frequency: 25MHz; Esr: 60Ω; Tolerance: 20ppm; Automotive: No; Series: ABM8G; Temperature Range High: +85°C; ComponentLink2URL: https://abracon.com/Resonators/ABM8G.pdf; RoHS: TRUE; Octopart: https://octopart.com/abm8g-25.000mhz-18-d2y-t-abracon-12676602; Package: ABM8G; Category: Crys; Device Class L2: Crystals / Oscillators; ComponentLink2Description: Datasheet; Manufacturer Part Number: ABM8G-25.000MHZ-18-D2Y-T; Height: 1mm; Lead Free: Yes; Digikey Description: CRYSTAL 25.0000MHZ 18PF SMD; Temperature Range Low: -40°C; Device Class L3: Crystals; Load Capacitance: 18pF; Temperature: -40°C to +85°C; Device Class L1: Passive Components; Mouser Description: Crystals 25.000MHz 18pF 30ppm -40C +85C

## Sheet 15-I225-MISC.SchDoc
size A; SheetNumber: 15; SheetTotal: 16
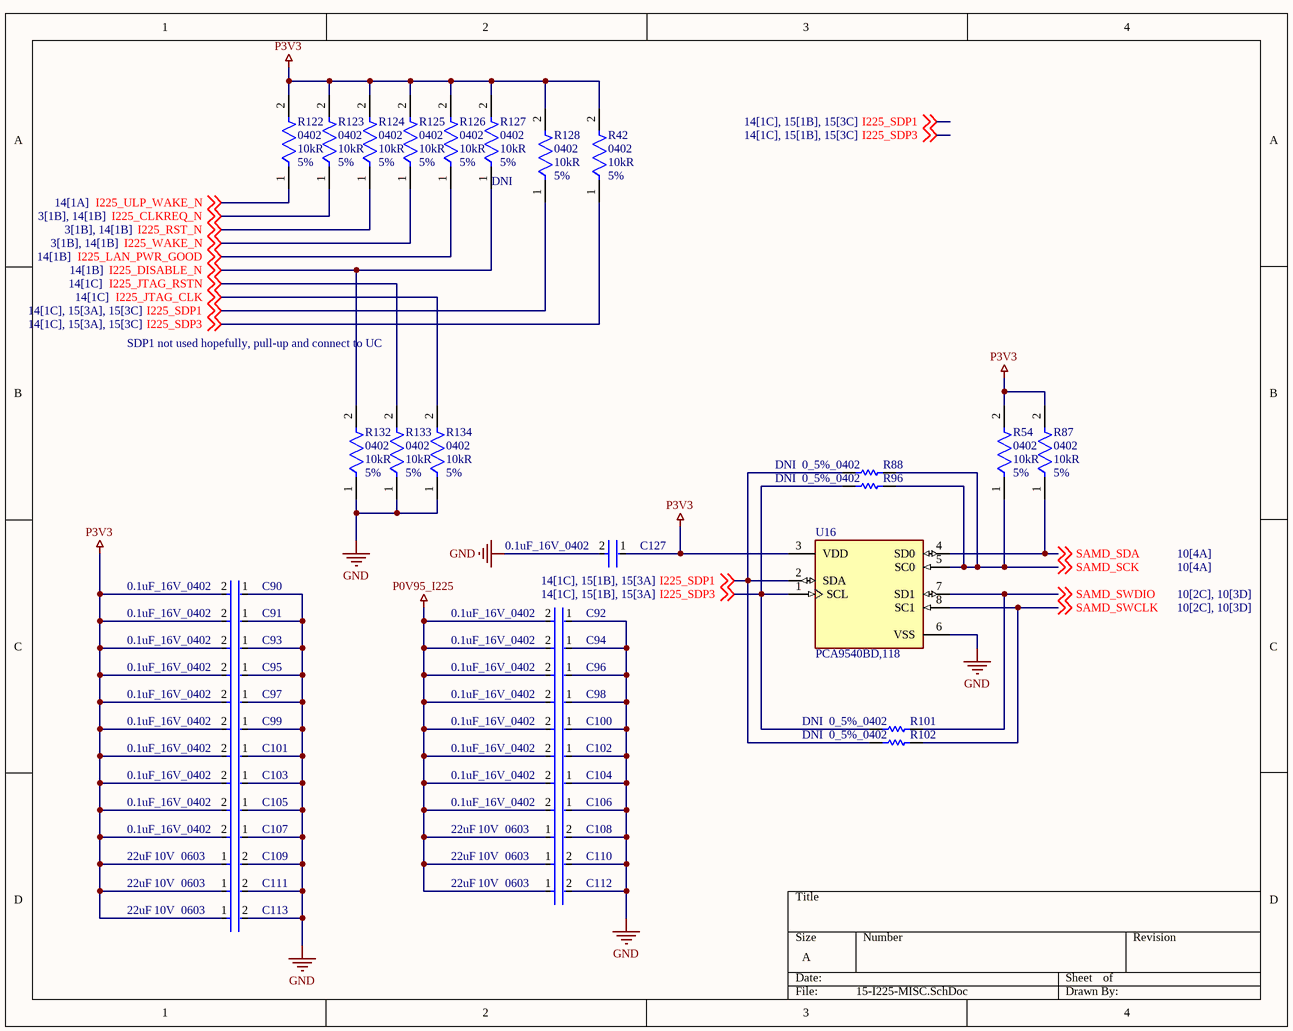
[diagram p10: 15-I225-MISC.SchDoc]

### Parts
C90  0.1uF_16V_0402  [FP-GRM15-MFG]
C91  0.1uF_16V_0402  [FP-GRM15-MFG]
C92  0.1uF_16V_0402  [FP-GRM15-MFG]
C93  0.1uF_16V_0402  [FP-GRM15-MFG]
C94  0.1uF_16V_0402  [FP-GRM15-MFG]
C95  0.1uF_16V_0402  [FP-GRM15-MFG]
C96  0.1uF_16V_0402  [FP-GRM15-MFG]
C97  0.1uF_16V_0402  [FP-GRM15-MFG]
C98  0.1uF_16V_0402  [FP-GRM15-MFG]
C99  0.1uF_16V_0402  [FP-GRM15-MFG]
C100  0.1uF_16V_0402  [FP-GRM15-MFG]
C101  0.1uF_16V_0402  [FP-GRM15-MFG]
C102  0.1uF_16V_0402  [FP-GRM15-MFG]
C103  0.1uF_16V_0402  [FP-GRM15-MFG]
C104  0.1uF_16V_0402  [FP-GRM15-MFG]
C105  0.1uF_16V_0402  [FP-GRM15-MFG]
C106  0.1uF_16V_0402  [FP-GRM15-MFG]
C107  0.1uF_16V_0402  [FP-GRM15-MFG]
C108  Capacitance: 22uF  Voltage Rating: 10V  Case Code (Imperial): 0603  [FP-GRM188-0_2-IPC_C]  (hidden comment: GRM188R61A226ME15D)
C109  Capacitance: 22uF  Voltage Rating: 10V  Case Code (Imperial): 0603  [FP-GRM188-0_2-IPC_C]  (hidden comment: GRM188R61A226ME15D)
C110  Capacitance: 22uF  Voltage Rating: 10V  Case Code (Imperial): 0603  [FP-GRM188-0_2-IPC_C]  (hidden comment: GRM188R61A226ME15D)
C111  Capacitance: 22uF  Voltage Rating: 10V  Case Code (Imperial): 0603  [FP-GRM188-0_2-IPC_C]  (hidden comment: GRM188R61A226ME15D)
C112  Capacitance: 22uF  Voltage Rating: 10V  Case Code (Imperial): 0603  [FP-GRM188-0_2-IPC_C]  (hidden comment: GRM188R61A226ME15D)
C113  Capacitance: 22uF  Voltage Rating: 10V  Case Code (Imperial): 0603  [FP-GRM188-0_2-IPC_C]  (hidden comment: GRM188R61A226ME15D)
C127  0.1uF_16V_0402  [FP-GRM15-MFG]
R42  Case/Package: 0402  Resistance: 10kR  Tolerance: 5%  [FP-CRCW0402-e3-IPC_B]  (hidden comment: CRCW040210K0JNED)
R54  Case/Package: 0402  Resistance: 10kR  Tolerance: 5%  [FP-CRCW0402-e3-IPC_B]  (hidden comment: CRCW040210K0JNED)
R87  Case/Package: 0402  Resistance: 10kR  Tolerance: 5%  [FP-CRCW0402-e3-IPC_B]  (hidden comment: CRCW040210K0JNED)
R88  0_5%_0402  [RESC1005X40X25LL10T10]
R96  0_5%_0402  [RESC1005X40X25LL10T10]
R101  0_5%_0402  [RESC1005X40X25LL10T10]
R102  0_5%_0402  [RESC1005X40X25LL10T10]
R122  Case/Package: 0402  Resistance: 10kR  Tolerance: 5%  [FP-CRCW0402-e3-IPC_B]  (hidden comment: CRCW040210K0JNED)
R123  Case/Package: 0402  Resistance: 10kR  Tolerance: 5%  [FP-CRCW0402-e3-IPC_B]  (hidden comment: CRCW040210K0JNED)
R124  Case/Package: 0402  Resistance: 10kR  Tolerance: 5%  [FP-CRCW0402-e3-IPC_B]  (hidden comment: CRCW040210K0JNED)
R125  Case/Package: 0402  Resistance: 10kR  Tolerance: 5%  [FP-CRCW0402-e3-IPC_B]  (hidden comment: CRCW040210K0JNED)
R126  Case/Package: 0402  Resistance: 10kR  Tolerance: 5%  [FP-CRCW0402-e3-IPC_B]  (hidden comment: CRCW040210K0JNED)
R127  Case/Package: 0402  Resistance: 10kR  Tolerance: 5%  [FP-CRCW0402-e3-IPC_B]  (hidden comment: CRCW040210K0JNED)
R128  Case/Package: 0402  Resistance: 10kR  Tolerance: 5%  [FP-CRCW0402-e3-IPC_B]  (hidden comment: CRCW040210K0JNED)
R132  Case/Package: 0402  Resistance: 10kR  Tolerance: 5%  [FP-CRCW0402-e3-IPC_B]  (hidden comment: CRCW040210K0JNED)
R133  Case/Package: 0402  Resistance: 10kR  Tolerance: 5%  [FP-CRCW0402-e3-IPC_B]  (hidden comment: CRCW040210K0JNED)
R134  Case/Package: 0402  Resistance: 10kR  Tolerance: 5%  [FP-CRCW0402-e3-IPC_B]  (hidden comment: CRCW040210K0JNED)
U16  PCA9540BD,118  [FP-SOT96-1-MFG]

### Nets
GND: C90.1 C91.1 C92.1 C93.1 C94.1 C95.1 C96.1 C97.1 C98.1 C99.1 C100.1 C101.1 C102.1 C103.1 C104.1 C105.1 C106.1 C107.1 C108.2 C109.2 C110.2 C111.2 C112.2 C113.2 C127.2 R132.1 R133.1 R134.1 U16.6(VSS)
P0V95_I225: C92.2 C94.2 C96.2 C98.2 C100.2 C102.2 C104.2 C106.2 C108.1 C110.1 C112.1
P3V3: C90.2 C91.2 C93.2 C95.2 C97.2 C99.2 C101.2 C103.2 C105.2 C107.2 C109.1 C111.1 C113.1 C127.1 R42.2 R54.2 R87.2 R122.2 R123.2 R124.2 R125.2 R126.2 R127.2 R128.2 U16.3(VDD)
I225_CLKREQ_N: R123.1 ; off-sheet I225_CLKREQ_N
I225_DISABLE_N: R127.1 R132.2 ; off-sheet I225_DISABLE_N
I225_JTAG_CLK: R134.2 ; off-sheet I225_JTAG_CLK
I225_JTAG_RSTN: R133.2 ; off-sheet I225_JTAG_RSTN
I225_LAN_PWR_GOOD: R126.1 ; off-sheet I225_LAN_PWR_GOOD
I225_RST_N: R124.1 ; off-sheet I225_RST_N
I225_SDP1: R88.1 R102.1 R128.1 U16.2(SDA) ; off-sheet I225_SDP1
I225_SDP3: R42.1 R96.1 R101.1 U16.1(SCL) ; off-sheet I225_SDP3
I225_ULP_WAKE_N: R122.1 ; off-sheet I225_ULP_WAKE_N
I225_WAKE_N: R125.1 ; off-sheet I225_WAKE_N
SAMD_SCK: R54.1 R88.2 R96.2 U16.5(SC0) ; off-sheet SAMD_SCK
SAMD_SDA: R87.1 U16.4(SD0) ; off-sheet SAMD_SDA
SAMD_SWCLK: R102.2 U16.8(SC1) ; off-sheet SAMD_SWCLK
SAMD_SWDIO: R101.2 U16.7(SD1) ; off-sheet SAMD_SWDIO

### Notes on the sheet
- SDP1 not used hopefully, pull-up and connect to UC

### Library data of the parts
C90-C107 C127 = CMP-2100-03641-2: as C47 on sheet 10-Microcontroller-1; RoHS: TRUE; Temperature Characteristic: X7R; Octopart: https://octopart.com/grm155r71c104ka88d-murata-196880; Digikey Description: CAP CER 0.1UF 16V X7R 0402; Device Class L3: Ceramic Capacitors; Height: 0.55mm; ComponentLink2Description: Datasheet; Temperature Range Low: -55°C; Ipc Land Pattern Name: CAPC10050X219; ComponentLink2URL: https://search.murata.co.jp/Ceramy/image/img/A01X/G101/ENG/GRM155R71H471KA01-01A.pdf; Device Class L1: Passive Components; Lead Free: yes; Category: Cap; Package: GRM15; Temperature: -55°C to +125°C; Device Class L2: Capacitors; Temperature Range High: +125°C; Mouser Description: 0402 0.1 uF 16V ±10 % Tolerance X7R SMT Multilayer Ceramic Capacitor
C108-C113 = CMP-2000-06337-3: Chip Multilayer Ceramic Capacitors for General Purpose, 0603, 22uF, X5R, 15%, 20%, 10V; Tolerance: 20%; Weight: 0.000222oz; Material: Ceramic; Depth: 0.8mm; Length: 1.6mm; Termination: SMD/SMT; Packaging: Tape and Reel; Width: 0.8mm; Mount: Surface Mount; Voltage Rating (DC): 10V; Case/Package: 0603; Thickness: 0.039inch; REACH SVHC: No SVHC; Dielectric: X5R; Height: 0.8mm; Package Quantity: 4000; Case Code (Metric): 1608; Min Operating Temperature: -55°C; Lead Free: Lead Free; Max Operating Temperature: 85°C
R42 R54 R87 R122-R128 R132-R134 = CMP-2002-08136-3: as R50 on sheet 10-Microcontroller-1; Military Standard: Not; Packaging: Tape and Reel; Case Code (Imperial): 0402; Min Operating Temperature: -55°C; Case Code (Metric): 1005; Temperature Coefficient: 200ppm/°C; Termination: SMD/SMT; Composition: Thick Film; Depth: 0.5mm; Number of Terminations: 2; Contact Plating: Tin; Height: 0.016inch; Width: 0.5mm; Max Operating Temperature: 155°C; Features: Automotive AEC-Q200; Length: 1mm; Radiation Hardening: No; Max Power Dissipation: 63mW; Mount: Surface Mount; Package Quantity: 1; Weight: 2.3E-05oz
  R127: DNI: DNI
R88 R96 R101 R102 = CMP-2002-04569-1: as R44 on sheet 10-Microcontroller-1; DNI: DNI
U16 = CMP-10118-000002-1: IC INTERFACE SPECIALIZED 8SO; Logic Function: Multiplexer; Max Frequency: 400kHz; Interface: I2C; Operating Supply Voltage: 5V; Number of Input Lines: 2; Min Supply Voltage: 2.3V; Number of Outputs: 1; On-State Resistance: 55R; Power Dissipation: 400mW; Max Supply Current: 65uA; Low Level Output Current: 6mA; Propagation Delay: 0.3ns; Max Supply Voltage: 5.5V; Number of Pins: 8; Packaging: Tape and Reel; Height: 1.45mm; Contact Plating: Gold; Weight: 0.01787oz; Package Quantity: 1; Number of Output Lines: 1; Lead Free: Lead Free; Radiation Hardening: No; Mount: Surface Mount; Quiescent Current: 65uA; Max Operating Temperature: 85°C; Number of Inputs: 2; Width: 4mm; Case/Package: SO; Min Operating Temperature: -40°C; Length: 5mm

## Sheet 16-Power.SchDoc
size A; SheetNumber: 16; SheetTotal: 16
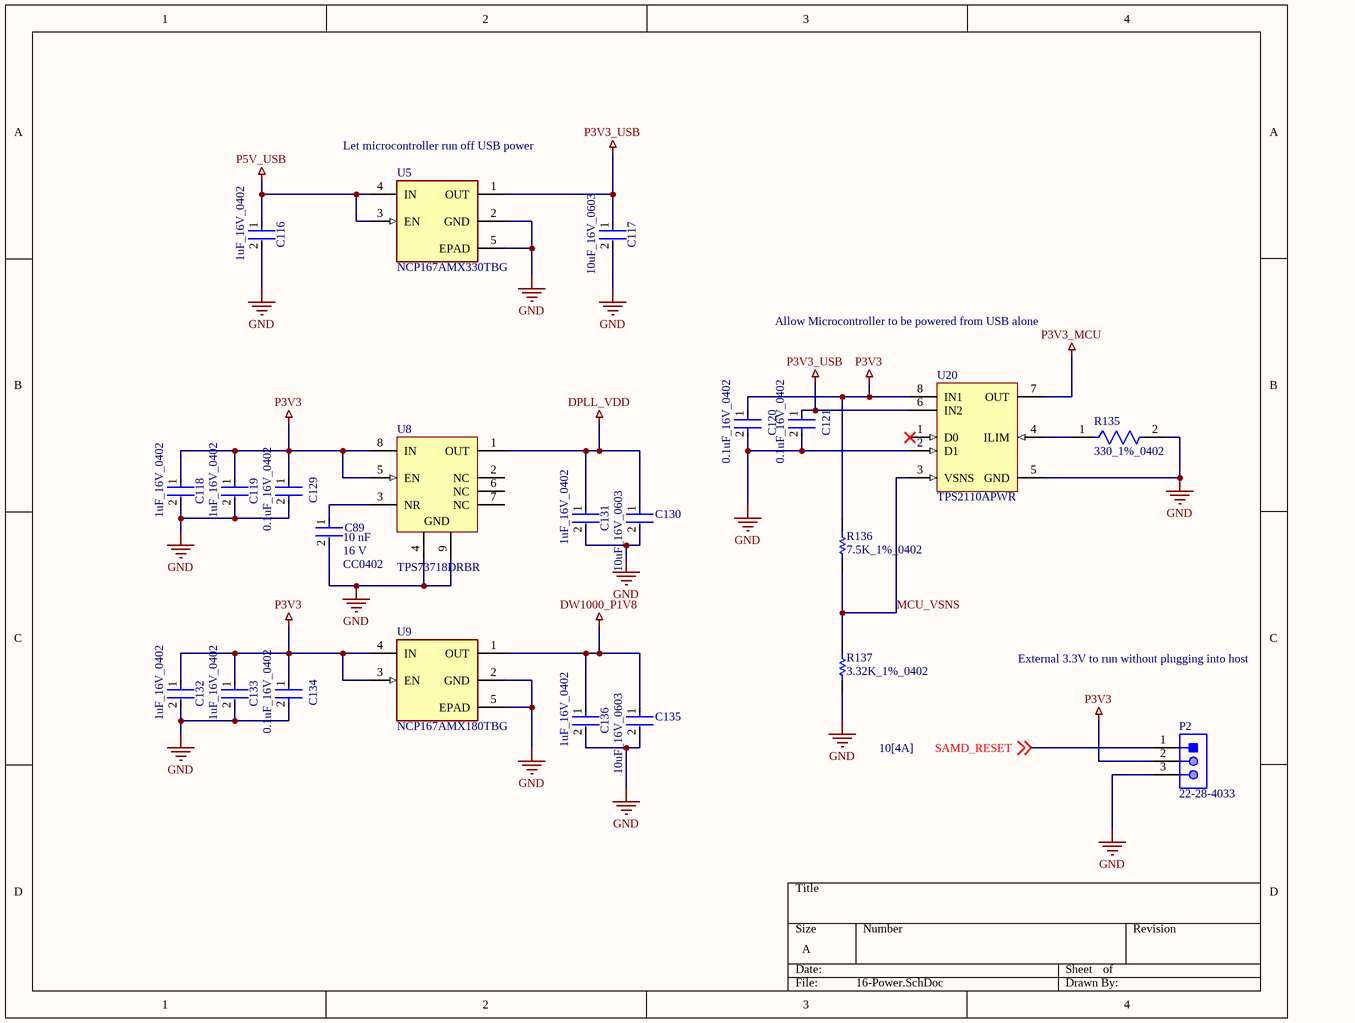
[diagram p11: 16-Power.SchDoc]

### Parts
C89  value 10 nF  Package: CC0402  Voltage Rating: 16 V  [FP-CC0402-MFG]  (hidden comment: CC0402KRX7R7BB103)
C116  1uF_16V_0402  [FP-0402-L_1_0_0_05-W_0_5-IPC_C]
C117  10uF_16V_0603  [FP-C1608-MFG]
C118  1uF_16V_0402  [FP-0402-L_1_0_0_05-W_0_5-IPC_C]
C119  1uF_16V_0402  [FP-0402-L_1_0_0_05-W_0_5-IPC_C]
C120  0.1uF_16V_0402  [FP-GRM15-MFG]
C121  0.1uF_16V_0402  [FP-GRM15-MFG]
C129  0.1uF_16V_0402  [FP-GRM15-MFG]
C130  10uF_16V_0603  [FP-MK107BA-IPC_A]
C131  1uF_16V_0402  [FP-0402-L_1_0_0_05-W_0_5-IPC_C]
C132  1uF_16V_0402  [FP-0402-L_1_0_0_05-W_0_5-IPC_C]
C133  1uF_16V_0402  [FP-0402-L_1_0_0_05-W_0_5-IPC_C]
C134  0.1uF_16V_0402  [FP-GRM15-MFG]
C135  10uF_16V_0603  [FP-MK107BA-IPC_A]
C136  1uF_16V_0402  [FP-0402-L_1_0_0_05-W_0_5-IPC_C]
P2  22-28-4033  [MOLX-22-28-4033_V]
R135  330_1%_0402  [FP-RC1005-IPC_B]
R136  7.5K_1%_0402  [RESC1005X40X25ML05T05]
R137  3.32K_1%_0402  [RESC1005X40X25NL05T05]
U5  NCP167AMX330TBG  [FP-711AJ-MFG]
U8  TPS73718DRBR  [DRB0008A_V]
U9  NCP167AMX180TBG  [FP-711AJ-MFG]
U20  TPS2110APWR  [PW0008A_L]

### Nets
DPLL_VDD: C130.1 C131.1 U8.1(OUT)
DW1000_P1V8: C135.1 C136.1 U9.1(OUT)
GND: C89.2 C116.2 C117.2 C118.2 C119.2 C120.2 C121.2 C129.2 C130.2 C131.2 C132.2 C133.2 C134.2 C135.2 C136.2 P2.3 R135.2 R137.1 U5.2(GND) U5.5(EPAD) U8.4(GND) U8.9(GND) U9.2(GND) U9.5(EPAD) U20.2(D1) U20.5(GND)
P3V3: C118.1 C119.1 C120.1 C129.1 C132.1 C133.1 C134.1 P2.2 R136.2 U8.5(EN) U8.8(IN) U9.3(EN) U9.4(IN) U20.8(IN1)
P3V3_MCU: U20.7(OUT)
P3V3_USB: C117.1 C121.1 U5.1(OUT) U20.6(IN2)
P5V_USB: C116.1 U5.3(EN) U5.4(IN)
MCU_VSNS: R136.1 R137.2 U20.3(VSNS)
SAMD_RESET: P2.1 ; off-sheet SAMD_RESET
NetC89_1: C89.1 U8.3(NR)
NetR135_1: R135.1 U20.4(ILIM)

Not connected (* = marked no-connect by the designer): U8 2(NC) 6(NC) 7(NC); U20 1(D0)*

### Notes on the sheet
- (near U5) Let microcontroller run off USB power
- Allow Microcontroller to be powered from USB alone
- External 3.3V to run without plugging into host

### Library data of the parts
C89 = CMP-03422-000501-1: CAP CER 10000PF 16V X7R 0402; Manufacturer: YAGEO; Automotive Grade: NA; Material: Ceramic; Tolerance: 0.1; Temperature Coefficient: 30ppm/°C; Temperature Range Low: -55°C; Temperature Range High: +125°C; Mouser Description: 0402 10 nF 16 V ±10 % Tolerance X7R SMT Multilayer Ceramic Capacitor; Footprint Url: http://www.yageo.com/exep/pages/download/literatures/UPY-C_GEN_24.pdf; Category: Cap; RoHS: TRUE; Capacitance: 10 nF; Manufacturer Part Number: CC0402KRX7R7BB103; ComponentLink2Description: Datasheet; Ipc Land Pattern Name: CAPC10050X50; Automotive: No; ComponentLink2URL: http://www.yageo.com/documents/recent/UPY-GP_NP0_16V-to-50V_16.pdf; Device Class L1: Passive Components; Height: 0.55mm; Temperature Characteristic: X7R; Device Class L3: Ceramic Capacitors; Lead Free: Yes; Device Class L2: Capacitors; Digikey Description: CAP CER 10000PF 16V X7R 0402; Octopart: https://octopart.com/cc0402krx7r7bb103-yageo-192895; Temperature: -55°C to +125°C
C116 C118 C119 C131-C133 C136 = CMP-14477-003537-2: None; Tolerance: 20%; Voltage Rating (DC): 16V; Capacitance: 1uF; Dielectric: X5R; Height: 0.5mm; Package Quantity: 10000; Series: M; Max Operating Temperature: 85°C; Width: 0.02inch; Mount: Surface Mount; Thickness: 0.022inch; Length: 1mm; Min Operating Temperature: -55°C; Depth: 0.5mm; RoHS Compliant: Yes; Construction: Flat; Case/Package: 0402; Radiation Hardening: No; Packaging: Tape and Reel; Voltage: 16V; Voltage Rating: 16V; Halogen Free: Halogen Free
C117 = CMP-08246-000019-1: CAP CER 10UF 16V X5R 0603; Manufacturer: TDK Corporation; Manufacturer Part Number: C1608X5R1C106M080AB; Temperature Coefficient: 15%; Tolerance: 20%; Material: Ceramic; Octopart: https://octopart.com/c1608x5r1c106m080ab-tdk-26013480; ComponentLink2Description: Datasheet; Value: 10uF; Temperature Range Low: -55°C; Digikey Description: CAP CER 10UF 16V X5R 0603; Package: C1608; Lead Free: Yes; Mouser Description: Multilayer Ceramic Capacitors MLCC - SMD/SMT 0603 10uF 16volts X5R +/-20% GP; Device Class L2: Capacitors; Voltage Rating: 16V; RoHS: TRUE; Automotive: No; Height: 0.9mm; Ipc Land Pattern Name: CAPC16080X80; ComponentLink2URL: https://upverter.com/datasheet/6fbac97fd59b4a24a005814037d2a36a27db40e9.pdf; Temperature Range High: +85°C; Capacitance: 10uF; Temperature: -55°C to +85°C; Category: Cap; Device Class L1: Passive Components; Device Class L3: Ceramic Capacitors; Temperature Characteristic: X5R
C120 C121 C129 C134 = CMP-2100-03641-2: as C47 on sheet 10-Microcontroller-1; RoHS: TRUE; Temperature Characteristic: X7R; Octopart: https://octopart.com/grm155r71c104ka88d-murata-196880; Digikey Description: CAP CER 0.1UF 16V X7R 0402; Device Class L3: Ceramic Capacitors; Height: 0.55mm; ComponentLink2Description: Datasheet; Temperature Range Low: -55°C; Ipc Land Pattern Name: CAPC10050X219; ComponentLink2URL: https://search.murata.co.jp/Ceramy/image/img/A01X/G101/ENG/GRM155R71H471KA01-01A.pdf; Device Class L1: Passive Components; Lead Free: yes; Category: Cap; Package: GRM15; Temperature: -55°C to +125°C; Device Class L2: Capacitors; Temperature Range High: +125°C; Mouser Description: 0402 0.1 uF 16V ±10 % Tolerance X7R SMT Multilayer Ceramic Capacitor
C130 C135 = CMP-2000-06226-3: None; Dielectric: X5R; Voltage Rating: 16V; Tolerance: 20%; Capacitance: 10uF; Packaging: Tape and Reel; Mount: Surface Mount; Height: 0.8mm; Series: M; Min Operating Temperature: -55°C; Max Operating Temperature: 85°C; Thickness: 0.031inch; Construction: Flat; Case/Package: 0603; Case Code (Metric): 1608; Package Quantity: 1; Case Code (Imperial): 0603; Voltage Rating (DC): 16V; Halogen Free: Halogen Free; Length: 0.063inch; Width: 0.031inch; Termination: SMD/SMT; RoHS Compliant: Yes
P2 = CMP-1676-00001-5: Male Header, Pitch 2.54 mm, 1 x 3 Position, Height 8.38 mm, Tail Length 3.18 mm, RoHS, Bulk; Manufacturer: Molex; Rows: 1; Voltage Rating: 250 V; Current Rating: 4 A; Min Operating Temperature: 0 degC; Lead Pitch: 0.1 inch; Packaging: Bulk; Contact Finish: Gold; RoHSCompliant: true; Contact Material: Brass; PackageReference: 22-28-4033; REACH SVHC: Unknown; PackageDescription: Male Header, Pitch 2.54 mm, 1 x 3 Position, Height 8.38 mm, Tail Length 3.18 mm; ComponentLink2URL: http://www.molex.com/pdm_docs/sd/022284033_sd.pdf; Height: 8.38 mm; Mounting Technology: Through Hole; ComponentLink1Description: Manufacturer URL; Length: 7.62 mm; Mount: Through Hole; DatasheetVersion: Rev. G, 01/2012; Max Operating Temperature: 75 degC; ComponentLink2Description: Datasheet; Colour: Black; Pins: 3; Contact Plating: Gold; Package Quantity: 1; ComponentLink1URL: http://www.molex.com/
R135 = CMP-13261-004965-1: Res Thick Film 0402 330Ω 1% 0.063W ±100ppm/°C Molded SMD T/R; Resistance: 330R; Max Power Dissipation: 63mW; Contact Plating: Tin; Case/Package: 0402; Width: 0.02inch; Min Operating Temperature: -55°C; Composition: Thick Film; Package Quantity: 1; Length: 0.039inch; Case Code (Imperial): 0402; Case Code (Metric): 1005; Height: 0.016inch; Features: Moisture Resistant; Radiation Hardening: No; Military Standard: Not; Depth: 0.5mm; Temperature Coefficient: 100ppm/°C; Max Operating Temperature: 155°C; Packaging: Tape and Reel; Tolerance: 1%; Number of Terminations: 2; Power Rating: 63mW
R136 = CMP-2002-00353-1: Manufacturer: Vishay Dale; Part Number: CRCW04027K50FKTD
R137 = CMP-1011-00568-2: Manufacturer: Vishay Dale; Part Number: CRCW04023K32FKTD
U5 = CMP-07128-000018-1: LDO 700 MA ULTRA-LOW NOI; Manufacturer: ON Semiconductor; Accuracy Percentage: 2%; Output Type: Fixed; Output Current: 700mA; Number Of Outputs: 1; Min Supply Voltage: 1.9V; Dropout Voltage: 190mV; Output Voltage: 3.3V; Standoff Height: 0mm; Max Supply Voltage: 5.5V; Max Junction Temp: +150°C; Nominal Supply Current: 9.7uA; Device Class L1: Integrated Circuits (ICs); Octopart: https://octopart.com/ncp167amx330tbg-on+semiconductor-85869721; Footprint Url: https://www.onsemi.com/pub/Collateral/711AJ.PDF; Height: 0.43mm; ComponentLink2Description: Datasheet; Temperature Range High: +150°C; Lead Free: Yes; Package: 711AJ; Device Class L3: Voltage Regulators - Linear; ComponentLink2URL: https://www.onsemi.com/pub/Collateral/NCP167-D.PDF; Temperature: to +150°C; Category: IC; Device Class L2: Power Management ICs; Digikey Description: LDO 700 MA ULTRA-LOW NOI; Manufacturer Part Number: NCP167AMX330TBG; Automotive: No; RoHS: TRUE
U8 = CMP-0395-00613-2: Single Output LDO, 1 A, Fixed 1.8 V Output, 2.2 to 5.5 V Input, with Reverse Current Protection, 8-pin SON (DRB), -40 to 125 degC, Green (RoHS & no Sb/Br); Manufacturer: Texas Instruments; Fixed Output Options(V): 1.8; Vin(Min)(V): 2.2; Iq(Typ)(mA): 0.3; Accuracy(%): 3; Vdo(Typ)(mV): 130; SubFamily: Single Channel LDO; Vin(Max)(V): 5.5; Iout(Max)(A): 1; Rating: Catalog; Vout Adj(Min)(V): 1.8; ComponentLink2Description: Datasheet; PartNumber: TPS73718DRBR; Vout Adj(Max)(V): 1.8; ComponentLink3URL: http://www.ti.com/litv/pdf/mpds118h; PackageDescription: 8-Pin Plastic Small Outline, Body 3 x 3 mm, Pitch 0.65 mm; ComponentLink1Description: Manufacturer URL; ComponentLink1URL: http://www.ti.com/; ComponentLink3Description: Package Specification; PackageVersion: 4203482-2/K; Eco-Plan: Green (RoHS & no Sb/Br); PackageReference: DRB0008A; Mounting Technology: Surface Mount; ComponentLink2URL: http://www.ti.com/general/docs/lit/getliterature.tsp?genericPartNumber=TPS73718&fileType=pdf; DatasheetVersion: SBVS067O
U9 = CMP-07128-000018-1: LDO 700 MA ULTRA-LOW NOI; Manufacturer: ON Semiconductor; Accuracy Percentage: 2%; Output Type: Fixed; Output Current: 700mA; Number Of Outputs: 1; Min Supply Voltage: 1.9V; Dropout Voltage: 190mV; Output Voltage: 1.8V; Standoff Height: 0mm; Max Supply Voltage: 5.5V; Max Junction Temp: +150°C; Nominal Supply Current: 9.7uA; Device Class L1: Integrated Circuits (ICs); Octopart: https://octopart.com/ncp167amx330tbg-on+semiconductor-85869721; Footprint Url: https://www.onsemi.com/pub/Collateral/711AJ.PDF; Height: 0.43mm; ComponentLink2Description: Datasheet; Temperature Range High: +150°C; Lead Free: Yes; Package: 711AJ; Device Class L3: Voltage Regulators - Linear; ComponentLink2URL: https://www.onsemi.com/pub/Collateral/NCP167-D.PDF; Temperature: to +150°C; Category: IC; Device Class L2: Power Management ICs; Digikey Description: LDO 700 MA ULTRA-LOW NOI; Manufacturer Part Number: NCP167AMX180TBG; Automotive: No; RoHS: TRUE
U20 = CMP-0339-00059-2: Dual In / Single Out Autoswitching Power Mux, 2.8 to 5.5 V, -40 to 85 degC, 8-pin TSSOP (PW), Green (RoHS & no Sb/Br); Manufacturer: Texas Instruments; SubFamily: Power Multiplexer (MUX); Number of Inputs: 2; IN2 Output Current(Max)(A): 0.75; IN1 rDS(on)(Typ)(mOhm): 120; IN1, IN2 Input Voltage(Max)(V): 5.5; IN2 rDS(on)(Typ)(Ohms): 0.12; IN1, IN2 Input Voltage(Min)(V): 2.8; PackageReference: PW0008A; ComponentLink1URL: http://www.ti.com/general/docs/lit/getliterature.tsp?genericPartNumber=TPS2110A&fileType=pdf; ComponentLink1Description: Datasheet; PackageDescription: 8-Pin Plastic Thin Small Outline Package 3 x 4.4 mm Body ,0.65 mm Pitch; Eco-Plan: Green (RoHS & no Sb/Br); PartNumber: TPS2110APWR; PackageVersion: revG, Feb-2011; Code_JEDEC: MO-153; IN1 Output Current(Max)(A): 0.75; Mounting Technology: Surface Mount; DatasheetVersion: SBVS043A